# EAGLE schematic led_uv (EAGLE 9.2.2)
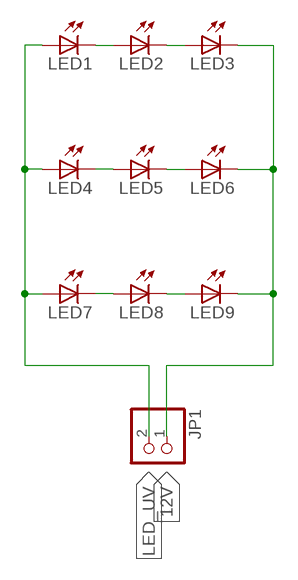
[diagram p0: schematic, sheet 1]

## Parts
JP1  PINHD-1X2  [1X02]
LED1  W49180  [Z-POWER-LED-DOME-TYPE]
LED2  W49180  [Z-POWER-LED-DOME-TYPE]
LED3  W49180  [Z-POWER-LED-DOME-TYPE]
LED4  W49180  [Z-POWER-LED-DOME-TYPE]
LED5  W49180  [Z-POWER-LED-DOME-TYPE]
LED6  W49180  [Z-POWER-LED-DOME-TYPE]
LED7  W49180  [Z-POWER-LED-DOME-TYPE]
LED8  W49180  [Z-POWER-LED-DOME-TYPE]
LED9  W49180  [Z-POWER-LED-DOME-TYPE]

## Nets
12V: JP1.1 LED3.C LED6.C LED9.C
LED_UV: JP1.2 LED1.A LED4.A LED7.A
N$25: LED1.C LED2.A
N$29: LED2.C LED3.A
N$41: LED8.C LED9.A
N$43: LED7.C LED8.A
N$44: LED5.C LED6.A
N$47: LED4.C LED5.A

## Library data of the parts
JP1 = pinhead:PINHD-1X2: PIN HEADER
LED1-LED9 = led:W49180: Z-Power LED P4 Series, Dome type Source: http://www.acriche.com .. W49180.pdf